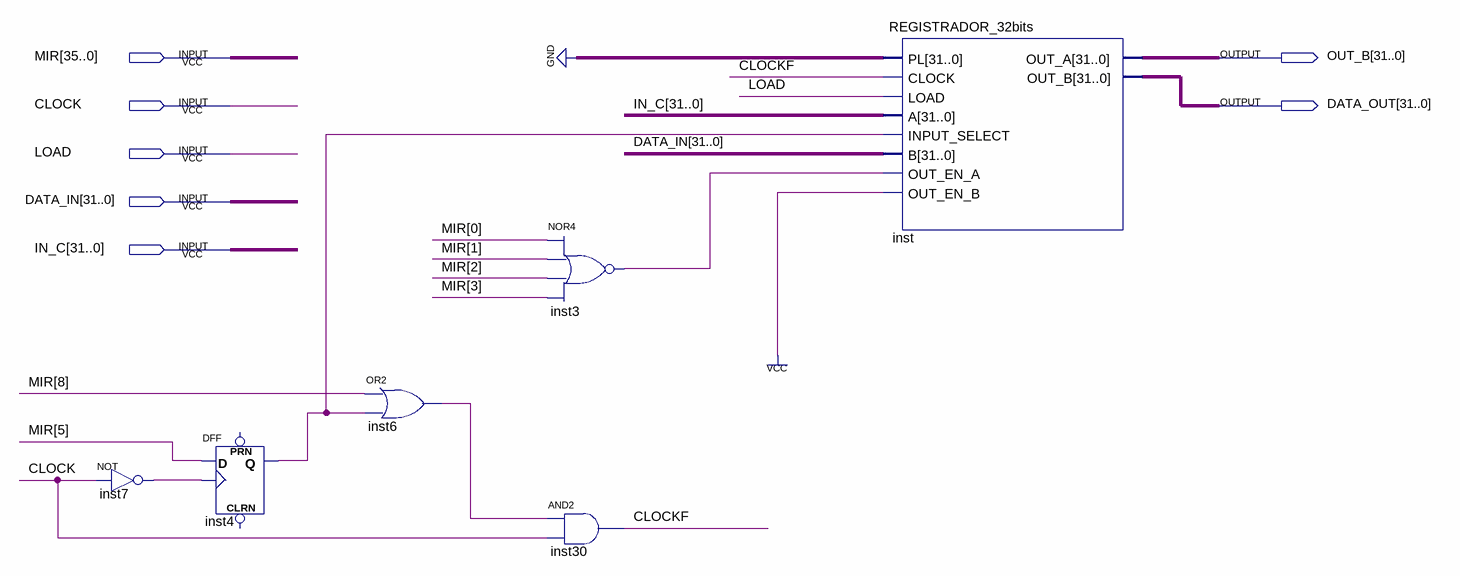
[diagram p0: schematic sheet]
// Quartus schematic MDR.bdf as structural Verilog: 6 symbols, 7 pins
module MDR (
  input  [35:0] MIR,
  input  CLOCK,
  input  LOAD,
  input  [31:0] DATA_IN,
  input  [31:0] IN_C,
  output [31:0] OUT_B,
  output [31:0] DATA_OUT
);

  wire CLOCKF, inst3_out, inst4_q, inst6_out, inst7_out;

  not inst7 (inst7_out, CLOCK);
  DFF inst4 (.CLK(inst7_out), .D(MIR[5]), .Q(inst4_q));  // open: CLRN, PRN
  or inst6 (inst6_out, MIR[8], inst4_q);
  nor inst3 (inst3_out, MIR[0], MIR[1], MIR[2], MIR[3]);
  and inst30 (CLOCKF, inst6_out, CLOCK);
  REGISTRADOR_32bits inst (
    .PL({32{1'b0}}), .CLOCK(CLOCKF), .LOAD(LOAD), .A(IN_C), .INPUT_SELECT(inst4_q), .B(DATA_IN),
    .OUT_EN_A(inst3_out), .OUT_EN_B(1'b1), .OUT_A(OUT_B), .OUT_B(DATA_OUT));
endmodule
